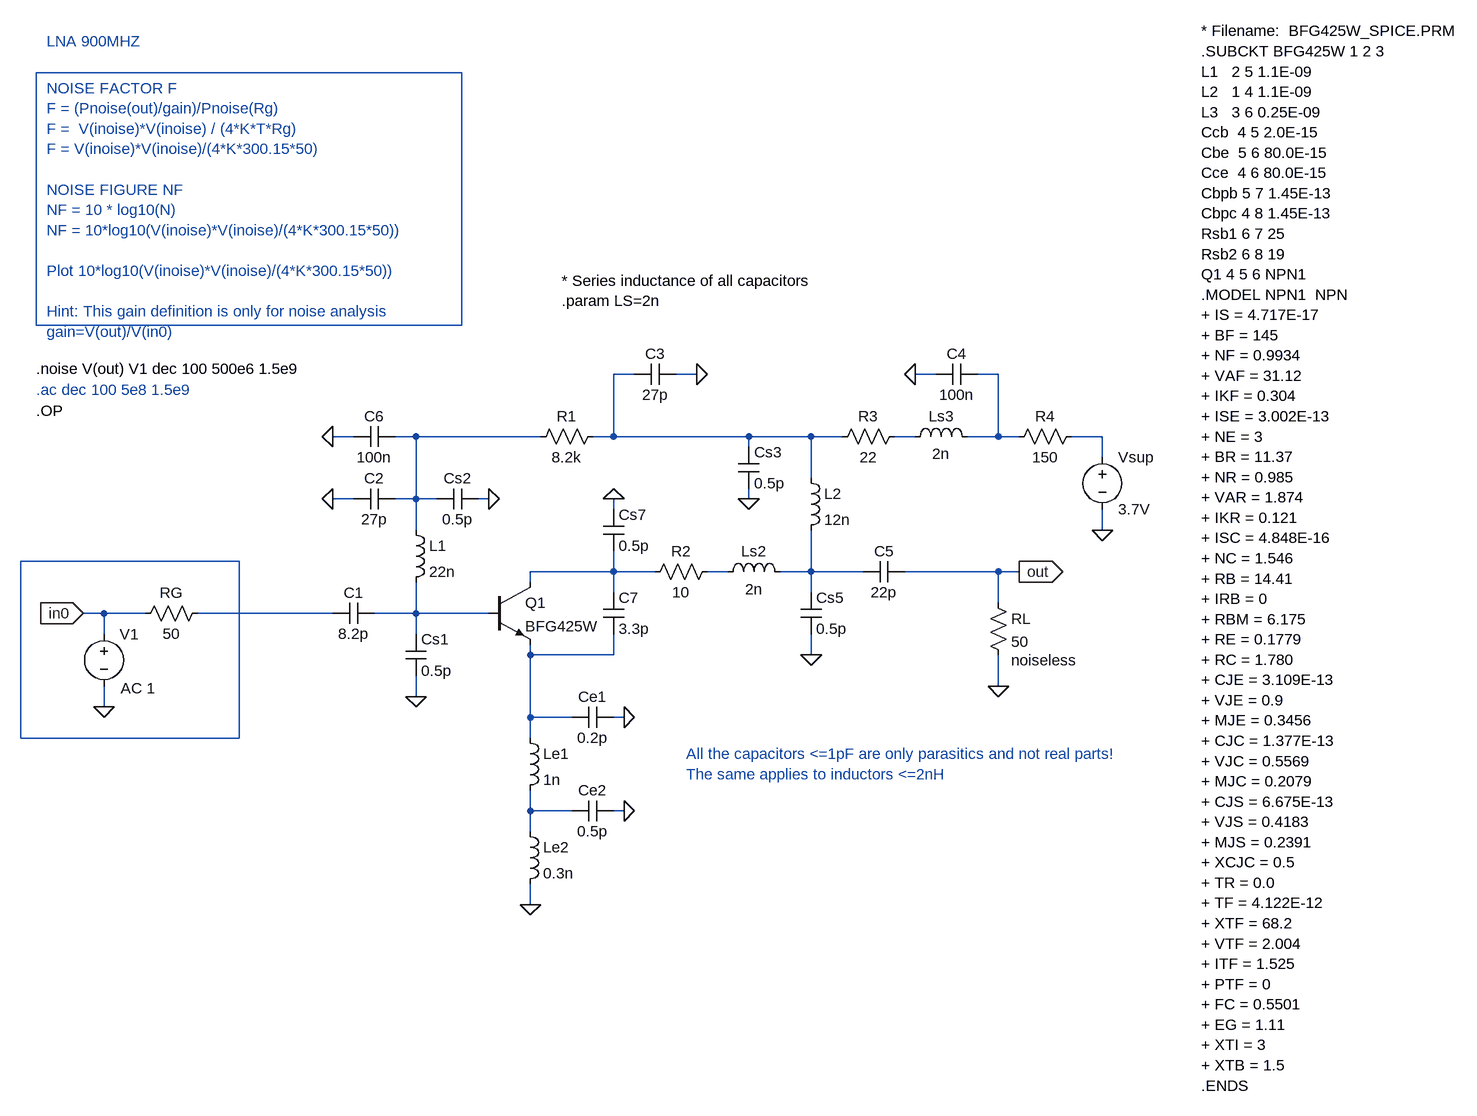
[diagram p0: schematic bfg425_test_NoiseFigure.asc]
bfg425_test_NoiseFigure.asc, the LTspice schematic file:
Version 4
SHEET 1 980 1528
WIRE -1200 832 -1232 832
WIRE -1200 864 -1200 832
WIRE -1200 976 -1200 944
WIRE -1136 832 -1200 832
WIRE -848 832 -1056 832
WIRE -816 560 -848 560
WIRE -816 656 -848 656
WIRE -720 560 -752 560
WIRE -720 656 -752 656
WIRE -720 656 -720 560
WIRE -720 704 -720 656
WIRE -720 832 -784 832
WIRE -720 832 -720 784
WIRE -720 864 -720 832
WIRE -720 960 -720 928
WIRE -688 656 -720 656
WIRE -608 656 -624 656
WIRE -608 832 -720 832
WIRE -544 784 -544 768
WIRE -544 896 -544 880
WIRE -544 992 -544 896
WIRE -544 1024 -544 992
WIRE -544 1136 -544 1104
WIRE -544 1168 -544 1136
WIRE -544 1280 -544 1248
WIRE -528 560 -720 560
WIRE -480 992 -544 992
WIRE -480 1136 -544 1136
WIRE -416 560 -448 560
WIRE -416 560 -416 464
WIRE -416 672 -416 656
WIRE -416 768 -544 768
WIRE -416 768 -416 736
WIRE -416 800 -416 768
WIRE -416 896 -544 896
WIRE -416 896 -416 864
WIRE -400 992 -416 992
WIRE -400 1136 -416 1136
WIRE -384 464 -416 464
WIRE -352 768 -416 768
WIRE -288 464 -320 464
WIRE -240 768 -272 768
WIRE -208 560 -416 560
WIRE -208 576 -208 560
WIRE -208 656 -208 640
WIRE -112 560 -208 560
WIRE -112 624 -112 560
WIRE -112 768 -160 768
WIRE -112 768 -112 704
WIRE -112 800 -112 768
WIRE -112 896 -112 864
WIRE -64 560 -112 560
WIRE -32 768 -112 768
WIRE 48 560 16 560
WIRE 80 464 48 464
WIRE 176 464 144 464
WIRE 176 560 128 560
WIRE 176 560 176 464
WIRE 176 768 32 768
WIRE 176 816 176 768
WIRE 176 944 176 896
WIRE 208 560 176 560
WIRE 208 768 176 768
WIRE 336 560 288 560
WIRE 336 592 336 560
WIRE 336 704 336 672
FLAG -544 1280 0
FLAG -400 992 0
FLAG -400 1136 0
FLAG 176 944 0
FLAG -1200 976 0
FLAG -848 560 0
FLAG -848 656 0
FLAG -288 464 0
FLAG 48 464 0
FLAG 336 704 0
FLAG -1232 832 in0
IOPIN -1232 832 In
FLAG 208 768 out
IOPIN 208 768 Out
FLAG -112 896 0
FLAG -416 656 0
FLAG -720 960 0
FLAG -608 656 0
FLAG -208 656 0
SYMBOL npn -608 784 R0
SYMATTR InstName Q1
SYMATTR Value BFG425W
SYMATTR Prefix X
SYMBOL ind -560 1008 R0
SYMATTR InstName Le1
SYMATTR Value 1n
SYMBOL cap -480 1008 R270
WINDOW 0 32 32 VTop 0
WINDOW 3 0 32 VBottom 0
SYMATTR InstName Ce1
SYMATTR Value 0.2p
SYMBOL cap -416 1120 R90
WINDOW 0 0 32 VBottom 0
WINDOW 3 32 32 VTop 0
SYMATTR InstName Ce2
SYMATTR Value 0.5p
SYMBOL ind -560 1152 R0
SYMATTR InstName Le2
SYMATTR Value 0.3n
SYMBOL ind -736 688 R0
SYMATTR InstName L1
SYMATTR Value 22n
SYMATTR SpiceLine Cpar=0.2p
SYMBOL res -544 576 R270
WINDOW 0 32 56 VTop 0
WINDOW 3 0 56 VBottom 0
SYMATTR InstName R1
SYMATTR Value 8.2k
SYMBOL cap -816 672 R270
WINDOW 0 32 32 VTop 0
WINDOW 3 0 32 VBottom 0
SYMATTR InstName C2
SYMATTR Value 27p
SYMATTR SpiceLine Lser={LS}
SYMBOL res 192 576 R270
WINDOW 0 32 56 VTop 0
WINDOW 3 0 56 VBottom 0
SYMATTR InstName R4
SYMATTR Value 150
SYMBOL cap -816 576 R270
WINDOW 0 32 32 VTop 0
WINDOW 3 0 32 VBottom 0
SYMATTR InstName C6
SYMATTR Value 100n
SYMATTR SpiceLine Lser={LS}
SYMBOL cap -384 480 R270
WINDOW 0 32 32 VTop 0
WINDOW 3 0 32 VBottom 0
SYMATTR InstName C3
SYMATTR Value 27p
SYMATTR SpiceLine Lser={LS}
SYMBOL res -80 576 R270
WINDOW 0 32 56 VTop 0
WINDOW 3 0 56 VBottom 0
SYMATTR InstName R3
SYMATTR Value 22
SYMBOL cap 80 480 R270
WINDOW 0 32 32 VTop 0
WINDOW 3 0 32 VBottom 0
SYMATTR InstName C4
SYMATTR Value 100n
SYMATTR SpiceLine Lser={LS}
SYMBOL cap -848 848 R270
WINDOW 0 32 32 VTop 0
WINDOW 3 0 32 VBottom 0
SYMATTR InstName C1
SYMATTR Value 8.2p
SYMATTR SpiceLine Lser={LS}
SYMBOL res -1152 848 R270
WINDOW 0 32 56 VTop 0
WINDOW 3 0 56 VBottom 0
SYMATTR InstName RG
SYMATTR Value 50
SYMBOL voltage -1200 848 R0
WINDOW 123 26 99 Left 0
WINDOW 39 0 0 Left 0
SYMATTR Value2 AC 1
SYMATTR InstName V1
SYMATTR Value ""
SYMBOL res -368 784 R270
WINDOW 0 32 56 VTop 0
WINDOW 3 0 56 VBottom 0
SYMATTR InstName R2
SYMATTR Value 10
SYMBOL ind -128 608 R0
SYMATTR InstName L2
SYMATTR Value 12n
SYMBOL cap -432 800 R0
SYMATTR InstName C7
SYMATTR Value 3.3p
SYMATTR SpiceLine Lser={LS}
SYMBOL cap -32 784 R270
WINDOW 0 32 32 VTop 0
WINDOW 3 0 32 VBottom 0
SYMATTR InstName C5
SYMATTR Value 22p
SYMATTR SpiceLine Lser={LS}
SYMBOL res 160 800 R0
WINDOW 123 36 104 Left 0
SYMATTR InstName RL
SYMATTR Value 50
SYMATTR Value2 noiseless
SYMBOL voltage 336 576 R0
SYMATTR InstName Vsup
SYMATTR Value 3.7V
SYMBOL cap -128 800 R0
SYMATTR InstName Cs5
SYMATTR Value 0.5p
SYMBOL cap -432 672 R0
SYMATTR InstName Cs7
SYMATTR Value 0.5p
SYMBOL cap -736 864 R0
SYMATTR InstName Cs1
SYMATTR Value 0.5p
SYMBOL ind -256 784 R270
WINDOW 0 32 56 VTop 0
WINDOW 3 5 56 VBottom 0
SYMATTR InstName Ls2
SYMATTR Value 2n
SYMBOL ind 32 576 R270
WINDOW 0 32 56 VTop 0
WINDOW 3 5 56 VBottom 0
SYMATTR InstName Ls3
SYMATTR Value 2n
SYMBOL cap -688 672 R270
WINDOW 0 32 32 VTop 0
WINDOW 3 0 32 VBottom 0
SYMATTR InstName Cs2
SYMATTR Value 0.5p
SYMBOL cap -224 576 R0
SYMATTR InstName Cs3
SYMATTR Value 0.5p
TEXT 488 -64 Left 0 !* Filename:  BFG425W_SPICE.PRM\n.SUBCKT BFG425W 1 2 3 \nL1   2 5 1.1E-09\nL2   1 4 1.1E-09\nL3   3 6 0.25E-09\nCcb  4 5 2.0E-15\nCbe  5 6 80.0E-15\nCce  4 6 80.0E-15\nCbpb 5 7 1.45E-13 \nCbpc 4 8 1.45E-13 \nRsb1 6 7 25 \nRsb2 6 8 19 \nQ1 4 5 6 NPN1 \n.MODEL NPN1  NPN \n+ IS = 4.717E-17 \n+ BF = 145 \n+ NF = 0.9934 \n+ VAF = 31.12 \n+ IKF = 0.304 \n+ ISE = 3.002E-13 \n+ NE = 3 \n+ BR = 11.37 \n+ NR = 0.985 \n+ VAR = 1.874 \n+ IKR = 0.121 \n+ ISC = 4.848E-16 \n+ NC = 1.546 \n+ RB = 14.41\n+ IRB = 0 \n+ RBM = 6.175 \n+ RE = 0.1779 \n+ RC = 1.780\n+ CJE = 3.109E-13 \n+ VJE = 0.9 \n+ MJE = 0.3456 \n+ CJC = 1.377E-13 \n+ VJC = 0.5569 \n+ MJC = 0.2079 \n+ CJS = 6.675E-13 \n+ VJS = 0.4183 \n+ MJS = 0.2391 \n+ XCJC = 0.5 \n+ TR = 0.0 \n+ TF = 4.122E-12 \n+ XTF = 68.2 \n+ VTF = 2.004 \n+ ITF = 1.525 \n+ PTF = 0 \n+ FC = 0.5501 \n+ EG = 1.11 \n+ XTI = 3 \n+ XTB = 1.5 \n.ENDS
TEXT -1288 -48 Left 0 ;LNA 900MHZ
TEXT -1304 488 Left 0 ;.ac dec 100 5e8 1.5e9
TEXT -496 320 Left 0 !* Series inductance of all capacitors\n.param LS=2n
TEXT -1304 520 Left 0 !.OP
TEXT -1304 456 Left 0 !.noise V(out) V1 dec 100 500e6 1.5e9
TEXT -304 1048 Left 0 ;All the capacitors <=1pF are only parasitics and not real parts!\nThe same applies to inductors <=2nH
TEXT -1288 24 Left 0 ;NOISE FACTOR F\nF = (Pnoise(out)/gain)/Pnoise(Rg) \nF =  V(inoise)*V(inoise) / (4*K*T*Rg)\nF = V(inoise)*V(inoise)/(4*K*300.15*50)\n \nNOISE FIGURE NF\nNF = 10 * log10(N)\nNF = 10*log10(V(inoise)*V(inoise)/(4*K*300.15*50))\n \nPlot 10*log10(V(inoise)*V(inoise)/(4*K*300.15*50))\n \nHint: This gain definition is only for noise analysis\ngain=V(out)/V(in0)
RECTANGLE Normal -650 389 -1304 0
RECTANGLE Normal -992 1024 -1328 752

The netlist it stands for:
* bfg425_test_NoiseFigure.asc
XQ1 N004 N003 N005 BFG425W  ; pins C B E
Le1 N005 N006 1n
Ce1 N005 0 0.2p
Ce2 0 N006 0.5p
Le2 N006 0 0.3n
L1 N002 N003 22n Cpar=0.2p
R1 N002 N007 8.2k
C2 0 N002 27p Lser={LS}
R4 N011 N012 150
C6 0 N002 100n Lser={LS}
C3 N007 0 27p Lser={LS}
R3 N007 N010 22
C4 0 N011 100n Lser={LS}
C1 N001 N003 8.2p Lser={LS}
RG in0 N001 50
V1 in0 0 AC 1
R2 N004 N008 10
L2 N007 N009 12n
C7 N004 N005 3.3p Lser={LS}
C5 N009 out 22p Lser={LS}
RL out 0 50 noiseless
Vsup N012 0 3.7V
Cs5 N009 0 0.5p
Cs7 0 N004 0.5p
Cs1 N003 0 0.5p
Ls2 N008 N009 2n
Ls3 N010 N011 2n
Cs2 N002 0 0.5p
Cs3 N007 0 0.5p
* Filename:  BFG425W_SPICE.PRM
.SUBCKT BFG425W 1 2 3
L1   2 5 1.1E-09
L2   1 4 1.1E-09
L3   3 6 0.25E-09
Ccb  4 5 2.0E-15
Cbe  5 6 80.0E-15
Cce  4 6 80.0E-15
Cbpb 5 7 1.45E-13
Cbpc 4 8 1.45E-13
Rsb1 6 7 25
Rsb2 6 8 19
Q1 4 5 6 NPN1
.MODEL NPN1  NPN
+ IS = 4.717E-17
+ BF = 145
+ NF = 0.9934
+ VAF = 31.12
+ IKF = 0.304
+ ISE = 3.002E-13
+ NE = 3
+ BR = 11.37
+ NR = 0.985
+ VAR = 1.874
+ IKR = 0.121
+ ISC = 4.848E-16
+ NC = 1.546
+ RB = 14.41
+ IRB = 0
+ RBM = 6.175
+ RE = 0.1779
+ RC = 1.780
+ CJE = 3.109E-13
+ VJE = 0.9
+ MJE = 0.3456
+ CJC = 1.377E-13
+ VJC = 0.5569
+ MJC = 0.2079
+ CJS = 6.675E-13
+ VJS = 0.4183
+ MJS = 0.2391
+ XCJC = 0.5
+ TR = 0.0
+ TF = 4.122E-12
+ XTF = 68.2
+ VTF = 2.004
+ ITF = 1.525
+ PTF = 0
+ FC = 0.5501
+ EG = 1.11
+ XTI = 3
+ XTB = 1.5
.ENDS
* LNA 900MHZ
* .ac dec 100 5e8 1.5e9
* Series inductance of all capacitors
.param LS=2n
.OP
.noise V(out) V1 dec 100 500e6 1.5e9
* All the capacitors <=1pF are only parasitics and not real parts!
* The same applies to inductors <=2nH
* NOISE FACTOR F
* F = (Pnoise(out)/gain)/Pnoise(Rg)
* F =  V(inoise)*V(inoise) / (4*K*T*Rg)
* F = V(inoise)*V(inoise)/(4*K*300.15*50)
* NOISE FIGURE NF
* NF = 10 * log10(N)
* NF = 10*log10(V(inoise)*V(inoise)/(4*K*300.15*50))
* Plot 10*log10(V(inoise)*V(inoise)/(4*K*300.15*50))
* Hint: This gain definition is only for noise analysis
* gain=V(out)/V(in0)
.backanno
.end